# Altium schematic sheet Interface.SchDoc
size A3; SheetNumber: 1; SheetTotal: 13
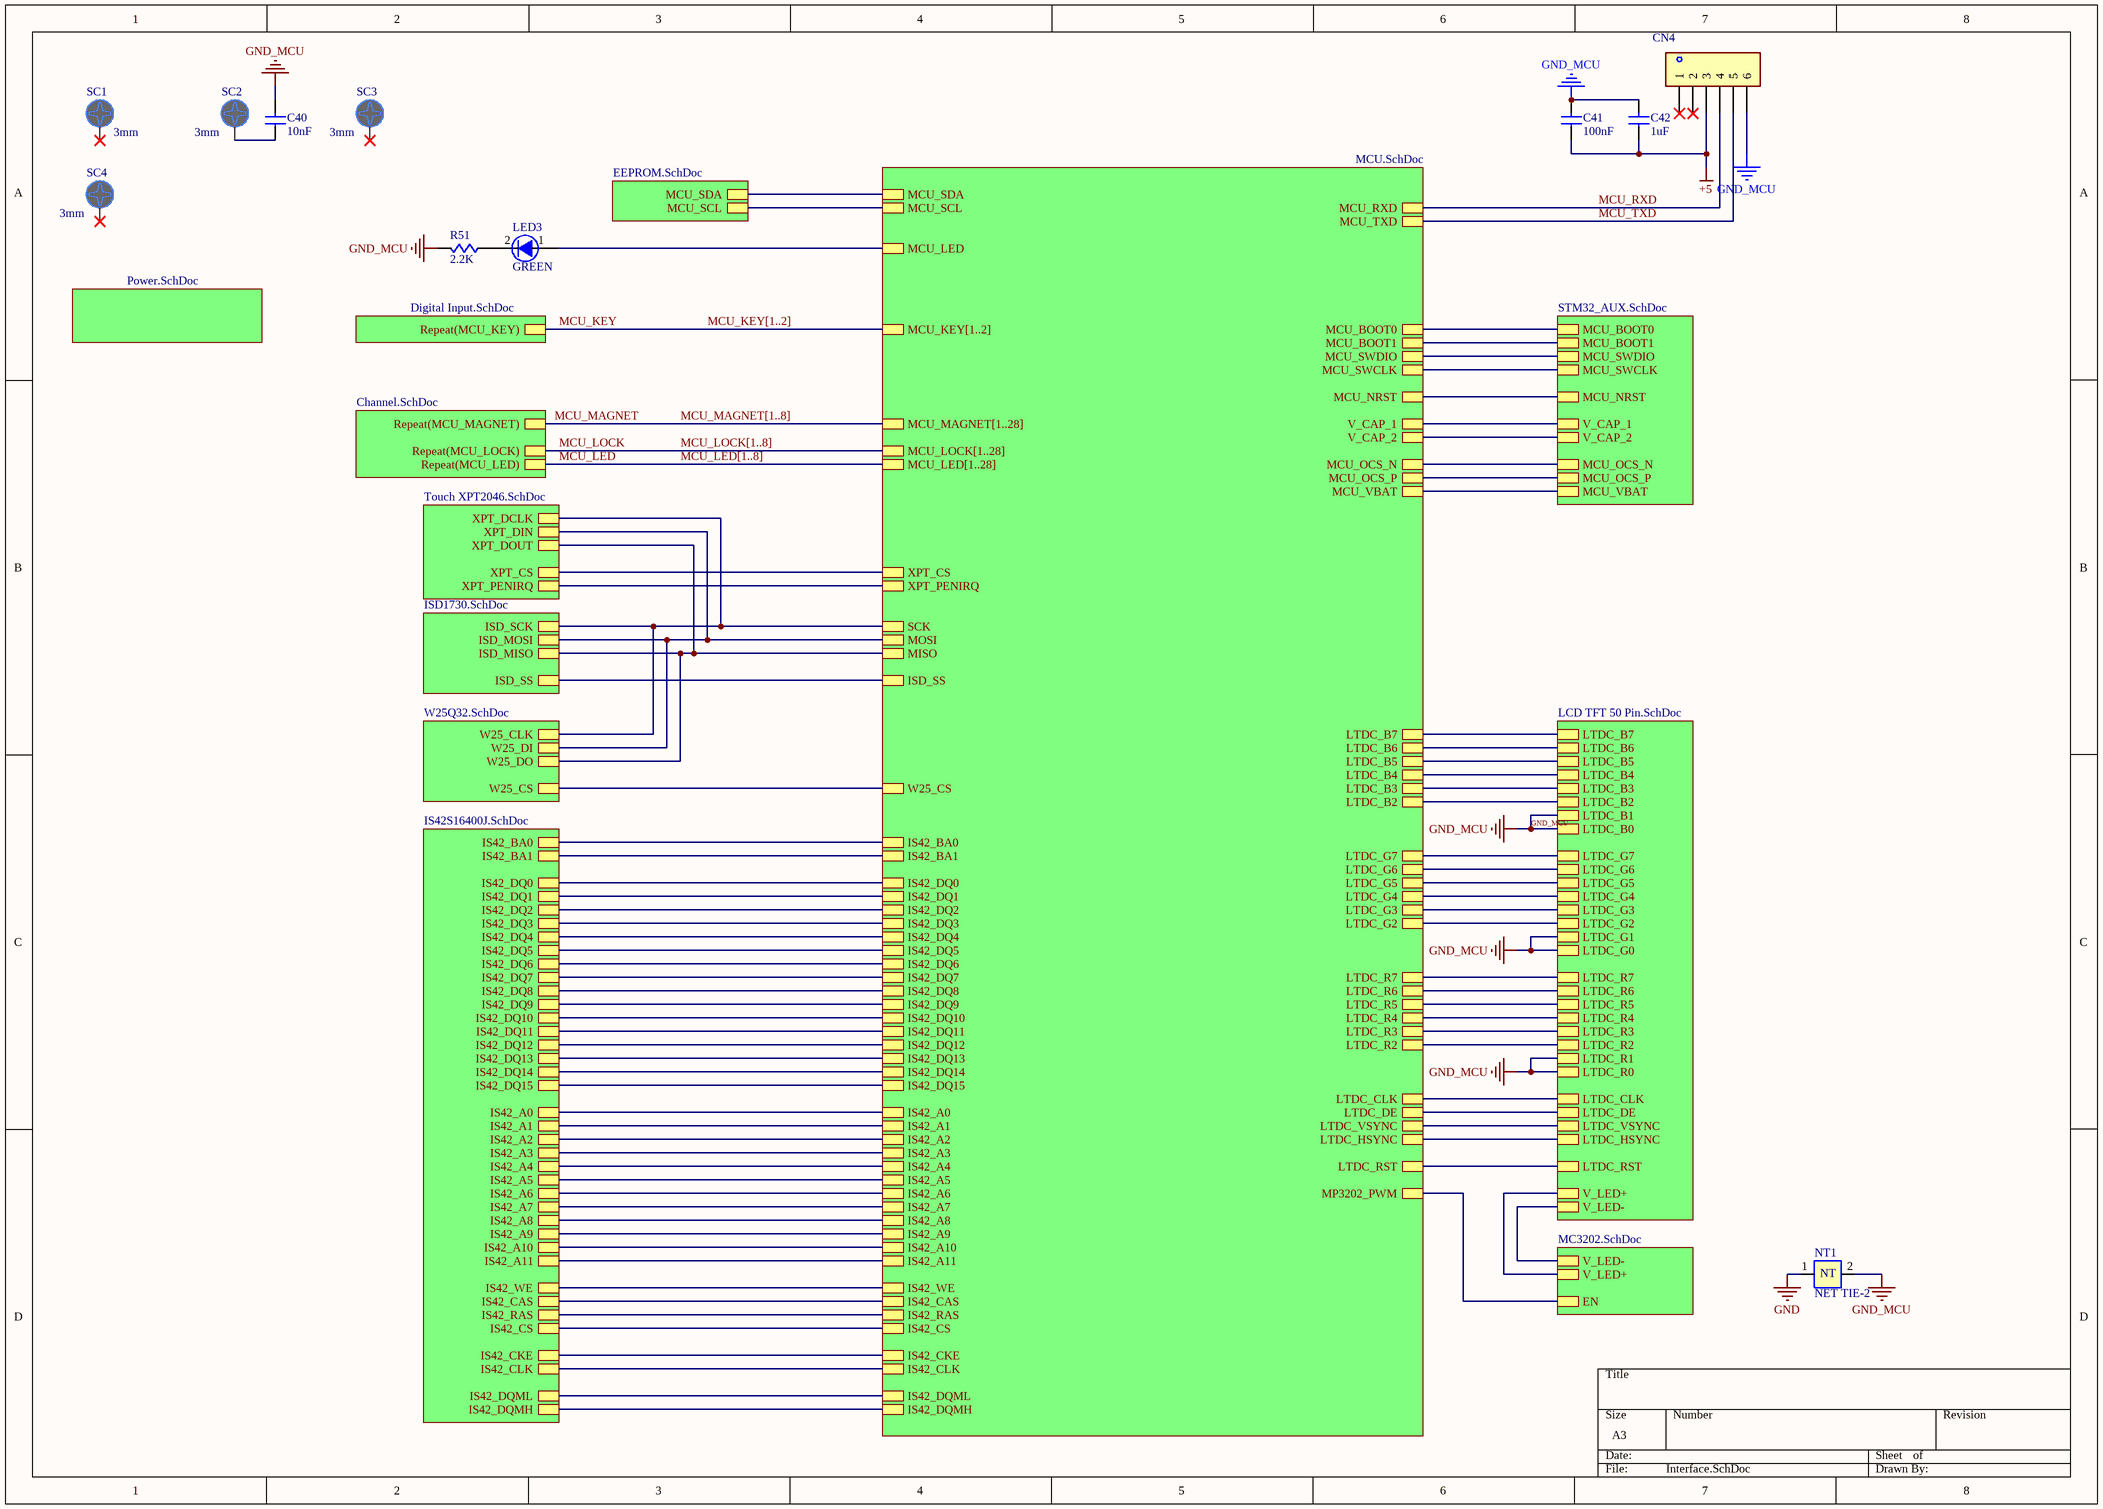
[diagram p0: Interface.SchDoc]

## Parts
C40  value 10nF  [CAP-CER-7x2.5-Ls5]  (hidden comment: CAP Cer 10nF-1KV-X7R-THD)
C41  value 100nF  [C-0805]  (hidden comment: CAP Cer 100nF-50V-X7R-SMD)
C42  value 1uF  [C-0805]  (hidden comment: CAP Cer 1uF-50V-X7R-SMD)
CN4  Connector XH-Straight-THD-2.54mm  [XH-6]  (value not drawn)
LED3  Color: GREEN  [LED-1206-Y]  (hidden comment: LED GREEN-1206-SMD)
NT1  NET TIE-2  [NET TIE-2]  (net tie, no BOM)
R51  value 2.2K  [R-0805]  (hidden comment: RES 2.2K-5%-1/8W-SMD)
SC1  Size: 3mm  [Screw_M3]  (hidden comment: Screw 3mm)
SC2  Size: 3mm  [Screw_M3]  (hidden comment: Screw 3mm)
SC3  Size: 3mm  [Screw_M3]  (hidden comment: Screw 3mm)
SC4  Size: 3mm  [Screw_M3]  (hidden comment: Screw 3mm)

## Sub-sheets
EEPROM = EEPROM.SchDoc: MCU_SDA, MCU_SCL
IS42S16400J = IS42S16400J.SchDoc: IS42_BA0, IS42_BA1, IS42_DQ0, IS42_DQ1, IS42_DQ2, IS42_DQ3, IS42_DQ4, IS42_DQ5, IS42_DQ6, IS42_DQ7, IS42_DQ8, IS42_DQ9, IS42_DQ10, IS42_DQ11, IS42_DQ12, IS42_DQ13, IS42_DQ14, IS42_DQ15, IS42_A0, IS42_A1, IS42_A2, IS42_A3, IS42_A4, IS42_A5, IS42_A6, IS42_A7, IS42_A8, IS42_A9, IS42_A10, IS42_A11, IS42_WE, IS42_CAS, IS42_RAS, IS42_CS, IS42_CKE, IS42_CLK, IS42_DQML, IS42_DQMH
ISD1730 = ISD1730.SchDoc: ISD_SCK, ISD_MOSI, ISD_MISO, ISD_SS
MC3202 = MC3202.SchDoc: V_LED-, V_LED+, EN
MCU = MCU.SchDoc: MCU_BOOT0, MCU_SWCLK, MCU_SWDIO, MCU_NRST, MCU_OCS_N, MCU_OCS_P, MCU_SDA, MCU_SCL, MCU_KEY[1..2], MCU_LOCK[1..28], MCU_LED[1..28], MCU_MAGNET[1..28], MCU_TXD, MCU_RXD, MCU_VBAT, MCU_LED, LTDC_B2, LTDC_B3, LTDC_B4, LTDC_B5, LTDC_B6, LTDC_B7, LTDC_G2, LTDC_G3, LTDC_G4, LTDC_G5, LTDC_G6, LTDC_G7, LTDC_R2, LTDC_R3, LTDC_R4, LTDC_R5, LTDC_R6, LTDC_R7, LTDC_CLK, LTDC_DE, LTDC_VSYNC, LTDC_HSYNC, LTDC_RST, MP3202_PWM, SCK, MOSI, MISO, ISD_SS, W25_CS, IS42_BA0, IS42_BA1, IS42_DQ0, IS42_DQ1, IS42_DQ2, IS42_DQ3, IS42_DQ4, IS42_DQ5, IS42_DQ6, IS42_DQ7, IS42_DQ8, IS42_DQ9, IS42_DQ10, IS42_DQ11, IS42_DQ12, IS42_DQ13, IS42_DQ14, IS42_DQ15, IS42_A0, IS42_A1, IS42_A2, IS42_A3, IS42_A4, IS42_A5, IS42_A6, IS42_A7, IS42_A8, IS42_A9, IS42_A10, IS42_A11, IS42_WE, IS42_CAS, IS42_RAS, IS42_CS, IS42_CKE, IS42_CLK, IS42_DQML, IS42_DQMH, MCU_BOOT1, V_CAP_1, V_CAP_2, XPT_CS, XPT_PENIRQ
Power = Power.SchDoc: no entries
Repeat(CHANNEL, 1, 8) = Channel.SchDoc: Repeat(MCU_LOCK), Repeat(MCU_LED), Repeat(MCU_MAGNET)
Repeat(KEY, 1, 2) = Digital Input.SchDoc: Repeat(MCU_KEY)
STM_AUX = STM32_AUX.SchDoc: MCU_BOOT0, MCU_SWCLK, MCU_SWDIO, MCU_NRST, MCU_OCS_N, MCU_OCS_P, MCU_VBAT, MCU_BOOT1, V_CAP_1, V_CAP_2
TFT = LCD TFT 50 Pin.SchDoc: LTDC_B0, LTDC_B1, LTDC_B2, LTDC_B3, LTDC_B4, LTDC_B5, LTDC_B6, LTDC_B7, LTDC_G0, LTDC_G1, LTDC_G2, LTDC_G3, LTDC_G4, LTDC_G5, LTDC_G6, LTDC_G7, LTDC_R0, LTDC_R1, LTDC_R2, LTDC_R3, LTDC_R4, LTDC_R5, LTDC_R6, LTDC_R7, LTDC_CLK, LTDC_DE, LTDC_VSYNC, LTDC_HSYNC, LTDC_RST, V_LED+, V_LED-
W25Q32 = W25Q32.SchDoc: W25_CLK, W25_DO, W25_DI, W25_CS
XPT2046 = Touch XPT2046.SchDoc: XPT_DCLK, XPT_DIN, XPT_DOUT, XPT_CS, XPT_PENIRQ

## Nets
+5: C41.1 C42.1 CN4.3
GND: NT1.1
GND_MCU: C40.2 C41.2 C42.2 CN4.6 NT1.2 R51.2 ; sheet TFT/LTDC_B0, sheet TFT/LTDC_B1, sheet TFT/LTDC_G0, sheet TFT/LTDC_G1, sheet TFT/LTDC_R0, sheet TFT/LTDC_R1
MCU_KEY: sheet Repeat(KEY, 1, 2)/Repeat(MCU_KEY)  [also labelled MCU_KEY[1..2]]
MCU_LED: sheet Repeat(CHANNEL, 1, 8)/Repeat(MCU_LED)
MCU_LOCK: sheet Repeat(CHANNEL, 1, 8)/Repeat(MCU_LOCK)
MCU_MAGNET: sheet Repeat(CHANNEL, 1, 8)/Repeat(MCU_MAGNET)
MCU_RXD: CN4.4 ; sheet MCU/MCU_RXD
MCU_TXD: CN4.5 ; sheet MCU/MCU_TXD
NetC40_1: C40.1 SC2.1
NetLED3_1: LED3.1(A) ; sheet MCU/MCU_LED
NetLED3_2: LED3.2(C) R51.1
(unnamed): sheet MCU/MCU_BOOT0, sheet STM_AUX/MCU_BOOT0
(unnamed): sheet MCU/MCU_SWCLK, sheet STM_AUX/MCU_SWCLK
(unnamed): sheet MCU/MCU_SWDIO, sheet STM_AUX/MCU_SWDIO
(unnamed): sheet MCU/MCU_NRST, sheet STM_AUX/MCU_NRST
(unnamed): sheet MCU/MCU_OCS_N, sheet STM_AUX/MCU_OCS_N
(unnamed): sheet MCU/MCU_OCS_P, sheet STM_AUX/MCU_OCS_P
(unnamed): sheet MCU/MCU_SDA, sheet EEPROM/MCU_SDA
(unnamed): sheet MCU/MCU_SCL, sheet EEPROM/MCU_SCL
(unnamed): sheet MCU/MCU_VBAT, sheet STM_AUX/MCU_VBAT
(unnamed): sheet MCU/LTDC_B2, sheet TFT/LTDC_B2
(unnamed): sheet MCU/LTDC_B3, sheet TFT/LTDC_B3
(unnamed): sheet MCU/LTDC_B4, sheet TFT/LTDC_B4
(unnamed): sheet MCU/LTDC_B5, sheet TFT/LTDC_B5
(unnamed): sheet MCU/LTDC_B6, sheet TFT/LTDC_B6
(unnamed): sheet MCU/LTDC_B7, sheet TFT/LTDC_B7
(unnamed): sheet MCU/LTDC_G2, sheet TFT/LTDC_G2
(unnamed): sheet MCU/LTDC_G3, sheet TFT/LTDC_G3
(unnamed): sheet MCU/LTDC_G4, sheet TFT/LTDC_G4
(unnamed): sheet MCU/LTDC_G5, sheet TFT/LTDC_G5
(unnamed): sheet MCU/LTDC_G6, sheet TFT/LTDC_G6
(unnamed): sheet MCU/LTDC_G7, sheet TFT/LTDC_G7
(unnamed): sheet MCU/LTDC_R2, sheet TFT/LTDC_R2
(unnamed): sheet MCU/LTDC_R3, sheet TFT/LTDC_R3
(unnamed): sheet MCU/LTDC_R4, sheet TFT/LTDC_R4
(unnamed): sheet MCU/LTDC_R5, sheet TFT/LTDC_R5
(unnamed): sheet MCU/LTDC_R6, sheet TFT/LTDC_R6
(unnamed): sheet MCU/LTDC_R7, sheet TFT/LTDC_R7
(unnamed): sheet MCU/LTDC_CLK, sheet TFT/LTDC_CLK
(unnamed): sheet MCU/LTDC_DE, sheet TFT/LTDC_DE
(unnamed): sheet MCU/LTDC_VSYNC, sheet TFT/LTDC_VSYNC
(unnamed): sheet MCU/LTDC_HSYNC, sheet TFT/LTDC_HSYNC
(unnamed): sheet MCU/LTDC_RST, sheet TFT/LTDC_RST
(unnamed): sheet MCU/MP3202_PWM, sheet MC3202/EN
(unnamed): sheet MCU/SCK, sheet W25Q32/W25_CLK, sheet ISD1730/ISD_SCK, sheet XPT2046/XPT_DCLK
(unnamed): sheet MCU/MOSI, sheet W25Q32/W25_DI, sheet ISD1730/ISD_MOSI, sheet XPT2046/XPT_DIN
(unnamed): sheet MCU/MISO, sheet W25Q32/W25_DO, sheet ISD1730/ISD_MISO, sheet XPT2046/XPT_DOUT
(unnamed): sheet MCU/ISD_SS, sheet ISD1730/ISD_SS
(unnamed): sheet MCU/W25_CS, sheet W25Q32/W25_CS
(unnamed): sheet MCU/IS42_BA0, sheet IS42S16400J/IS42_BA0
(unnamed): sheet MCU/IS42_BA1, sheet IS42S16400J/IS42_BA1
(unnamed): sheet MCU/IS42_DQ0, sheet IS42S16400J/IS42_DQ0
(unnamed): sheet MCU/IS42_DQ1, sheet IS42S16400J/IS42_DQ1
(unnamed): sheet MCU/IS42_DQ2, sheet IS42S16400J/IS42_DQ2
(unnamed): sheet MCU/IS42_DQ3, sheet IS42S16400J/IS42_DQ3
(unnamed): sheet MCU/IS42_DQ4, sheet IS42S16400J/IS42_DQ4
(unnamed): sheet MCU/IS42_DQ5, sheet IS42S16400J/IS42_DQ5
(unnamed): sheet MCU/IS42_DQ6, sheet IS42S16400J/IS42_DQ6
(unnamed): sheet MCU/IS42_DQ7, sheet IS42S16400J/IS42_DQ7
(unnamed): sheet MCU/IS42_DQ8, sheet IS42S16400J/IS42_DQ8
(unnamed): sheet MCU/IS42_DQ9, sheet IS42S16400J/IS42_DQ9
(unnamed): sheet MCU/IS42_DQ10, sheet IS42S16400J/IS42_DQ10
(unnamed): sheet MCU/IS42_DQ11, sheet IS42S16400J/IS42_DQ11
(unnamed): sheet MCU/IS42_DQ12, sheet IS42S16400J/IS42_DQ12
(unnamed): sheet MCU/IS42_DQ13, sheet IS42S16400J/IS42_DQ13
(unnamed): sheet MCU/IS42_DQ14, sheet IS42S16400J/IS42_DQ14
(unnamed): sheet MCU/IS42_DQ15, sheet IS42S16400J/IS42_DQ15
(unnamed): sheet MCU/IS42_A0, sheet IS42S16400J/IS42_A0
(unnamed): sheet MCU/IS42_A1, sheet IS42S16400J/IS42_A1
(unnamed): sheet MCU/IS42_A2, sheet IS42S16400J/IS42_A2
(unnamed): sheet MCU/IS42_A3, sheet IS42S16400J/IS42_A3
(unnamed): sheet MCU/IS42_A4, sheet IS42S16400J/IS42_A4
(unnamed): sheet MCU/IS42_A5, sheet IS42S16400J/IS42_A5
(unnamed): sheet MCU/IS42_A6, sheet IS42S16400J/IS42_A6
(unnamed): sheet MCU/IS42_A7, sheet IS42S16400J/IS42_A7
(unnamed): sheet MCU/IS42_A8, sheet IS42S16400J/IS42_A8
(unnamed): sheet MCU/IS42_A9, sheet IS42S16400J/IS42_A9
(unnamed): sheet MCU/IS42_A10, sheet IS42S16400J/IS42_A10
(unnamed): sheet MCU/IS42_A11, sheet IS42S16400J/IS42_A11
(unnamed): sheet MCU/IS42_WE, sheet IS42S16400J/IS42_WE
(unnamed): sheet MCU/IS42_CAS, sheet IS42S16400J/IS42_CAS
(unnamed): sheet MCU/IS42_RAS, sheet IS42S16400J/IS42_RAS
(unnamed): sheet MCU/IS42_CS, sheet IS42S16400J/IS42_CS
(unnamed): sheet MCU/IS42_CKE, sheet IS42S16400J/IS42_CKE
(unnamed): sheet MCU/IS42_CLK, sheet IS42S16400J/IS42_CLK
(unnamed): sheet MCU/IS42_DQML, sheet IS42S16400J/IS42_DQML
(unnamed): sheet MCU/IS42_DQMH, sheet IS42S16400J/IS42_DQMH
(unnamed): sheet MCU/MCU_BOOT1, sheet STM_AUX/MCU_BOOT1
(unnamed): sheet MCU/V_CAP_1, sheet STM_AUX/V_CAP_1
(unnamed): sheet MCU/V_CAP_2, sheet STM_AUX/V_CAP_2
(unnamed): sheet MCU/XPT_CS, sheet XPT2046/XPT_CS
(unnamed): sheet MCU/XPT_PENIRQ, sheet XPT2046/XPT_PENIRQ
(unnamed): sheet TFT/V_LED+, sheet MC3202/V_LED+
(unnamed): sheet TFT/V_LED-, sheet MC3202/V_LED-

Not connected (* = marked no-connect by the designer): CN4 1* 2*; SC1 1*; SC3 1*; SC4 1*

## Buses and harness runs
bus MCU_LED[1..8] = sheet MCU/MCU_LED[1..28]
bus MCU_LOCK[1..8] = sheet MCU/MCU_LOCK[1..28]
bus MCU_MAGNET[1..8] = sheet MCU/MCU_MAGNET[1..28]

## Notes on the sheet
- (in symbol NET TIE-2) NT

## Library data of the parts
C40 = CAP-CER: CAPACITOR; Phone Number: 0915 8700 314; Voltage: 1KV; Tolerance: X7R; Type: THD; Publisher: Mahdi Bagherzadeh; ComponentLink1Description: Linkedin; ComponentLink1URL: https://ir.linkedin.com/in/mahdi-bagherzade; Published Date: 9-15-2024
C41 C42 = CAP-CER: CAPACITOR; Phone Number: 0915 8700 314; Voltage: 50V; Tolerance: X7R; Type: SMD; Publisher: Mahdi Bagherzadeh; ComponentLink1Description: Linkedin; ComponentLink1URL: https://ir.linkedin.com/in/mahdi-bagherzade; Published Date: 9-15-2024
CN4 = CN-6pin: CONNECTOR; Phone Number: 0915 8700 314; Value: XH; Publisher: Mahdi Bagherzadeh; ComponentLink1Description: Linkedin; ComponentLink1URL: https://ir.linkedin.com/in/mahdi-bagherzade; Published Date: 9-15-2024; Size: 2.54mm; Type: Straight-THD
LED3 = LED: Phone Number: 0915 8700 314; Type: SMD; Publisher: Mahdi Bagherzadeh; ComponentLink1Description: Linkedin; ComponentLink1URL: https://ir.linkedin.com/in/mahdi-bagherzade; Published Date: 9-15-2024; Size: 1206
NT1 = NET TIE-2: Phone Number: 0915 8700 314; Publisher: Mahdi Bagherzadeh; ComponentLink1Description: Linkedin; ComponentLink1URL: https://ir.linkedin.com/in/mahdi-bagherzade; Published Date: 9-15-2024
R51 = RES: RESISTOR; Phone Number: 0915 8700 314; Tolerance: 5%; Power: 1/8W; Publisher: Mahdi Bagherzadeh; ComponentLink1Description: Linkedin; ComponentLink1URL: https://ir.linkedin.com/in/mahdi-bagherzade; Published Date: 9-15-2024; Type: SMD
SC1-SC4 = SCREW: Phone Number: 0915 8700 314; Publisher: Mahdi Bagherzadeh; ComponentLink1Description: Linkedin; ComponentLink1URL: https://ir.linkedin.com/in/mahdi-bagherzade; Published Date: 9-15-2024